# Altium schematic sheet 02_Power_Diagram.SchDoc
size A4; CheckedBy: Doo; Author: Doo; DrawnBy: Doo; DocumentNumber: PIF_C24_VRS02; Revision: RV_01; SheetNumber: 3; SheetTotal: 7
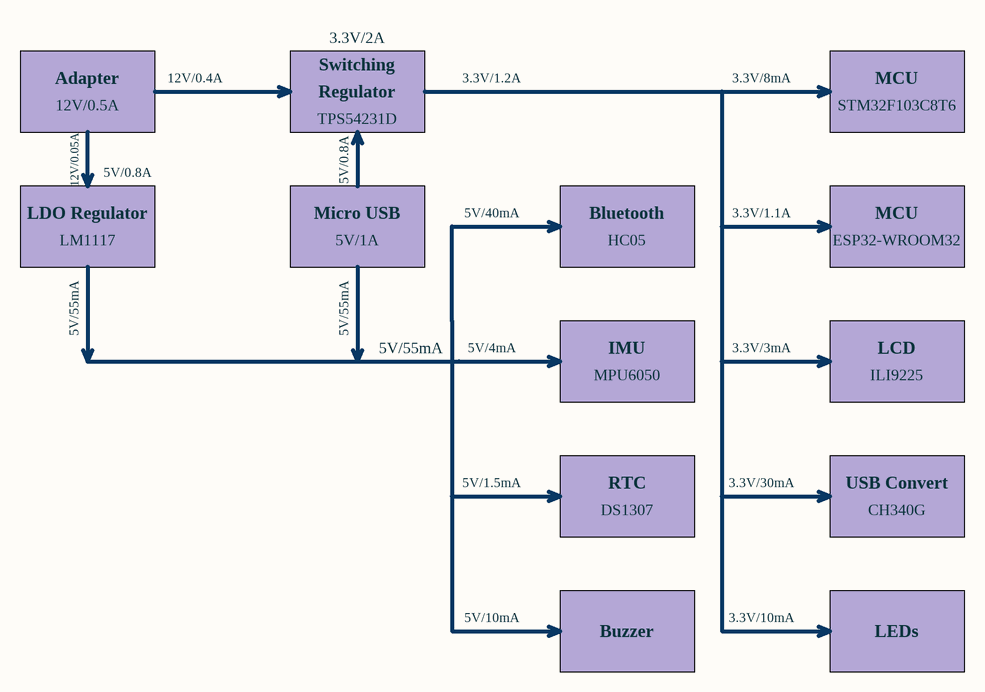
[diagram p0: 02_Power_Diagram.SchDoc]

## Notes on the sheet
- Adapter
- 12V/0.4A
- Switching
- Regulator
- 3.3V/2A
- 3.3V/1.2A
- 3.3V/8mA
- MCU
- 12V/0.05A
- 12V/0.5A
- 5V/0.8A
- TPS54231D
- STM32F103C8T6
- LDO Regulator
- Micro USB
- 5V/40mA
- Bluetooth
- 3.3V/1.1A
- LM1117
- 5V/1A
- HC05
- ESP32-WROOM32
- 5V/55mA
- 5V/4mA
- IMU
- 3.3V/3mA
- LCD
- MPU6050
- ILI9225
- 5V/1.5mA
- RTC
- 3.3V/30mA
- USB Convert
- DS1307
- CH340G
- 5V/10mA
- Buzzer
- 3.3V/10mA
- LEDs
- Title
- Size
- Date:
- Drawn By:
- A4
- YEN_DOO
- Number
- Revision
- Checked By:
- Time:
- File: